# Altium schematic sheet Unijunction Transistor.schdoc: Unijunction Transistor
size A4; Organization: Altium Limited; Address1: L3, 12a Rodborough Rd; Address2: Frenchs Forest; Address3: NSW; Address4: Australia 2086; DocumentNumber: 1; SheetNumber: 1; SheetTotal: 1
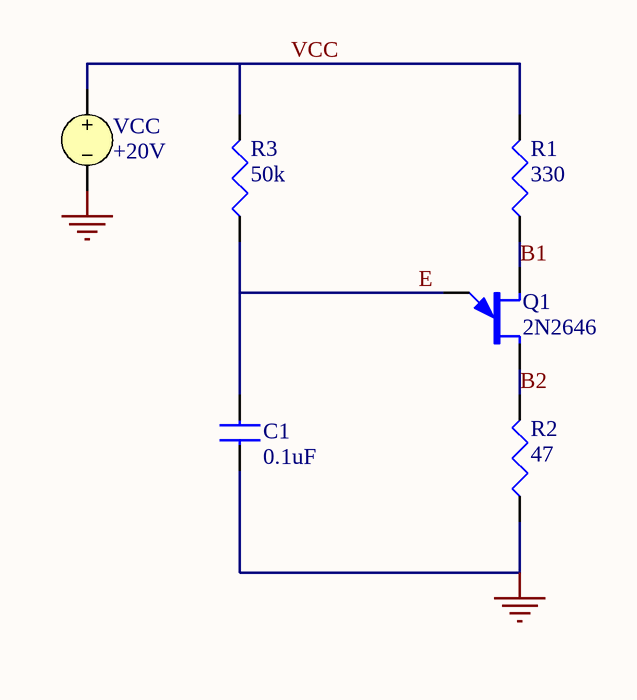
[diagram p0: Unijunction Transistor.schdoc]

## Parts
C1  0.1uF
Q1  2N2646
R1  330
R2  47
R3  50k
VCC  +20V

## Nets
GND: C1.2 R2.2(BOT) VCC.2
B1: Q1.1(B2) R1.2(BOT)
B2: Q1.3(B1) R2.1(TOP)
E: C1.1 Q1.2(E) R3.2(BOT)
VCC: R1.1(TOP) R3.1(TOP) VCC.1

## Notes on the sheet
- Title
- Size:
- Date:
- A4
- Number:
- Time:
- Revision:
- Sheet
- of
- File:

## Library data of the parts
C1 = CAP: Capacitor; Value: 0.1uF
Q1 = 2N2646: Unijunction Transistor
R1-R3 = RES: Resistor
  R1: Value: 330
  R2: Value: 47
  R3: Value: 50k
VCC = VSRC: Voltage Source; Value: +20V